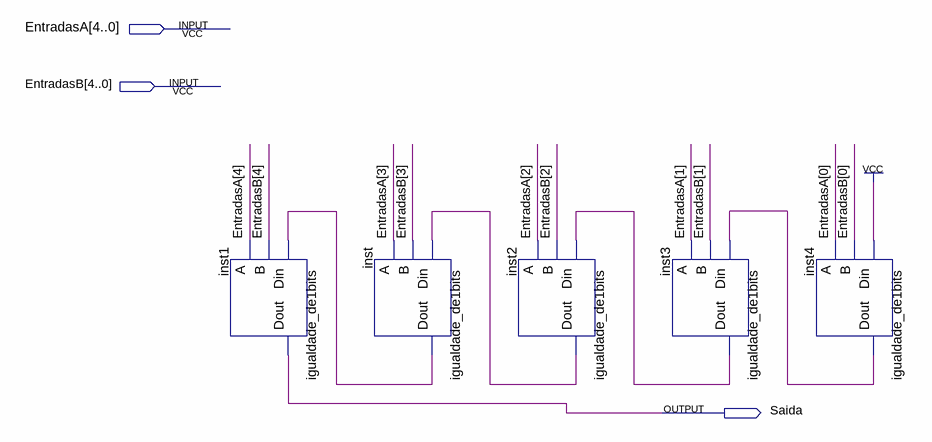
[diagram p0: schematic sheet]
// Quartus schematic igualdade_completo.bdf as structural Verilog: 5 symbols, 3 pins
module igualdade_completo (
  input  [4:0] EntradasA,
  input  [4:0] EntradasB,
  output Saida
);

  wire inst2_dout, inst3_dout, inst4_dout, inst_dout;

  igualdade_de1bits inst1 (.Din(inst_dout), .B(EntradasB[4]), .A(EntradasA[4]), .Dout(Saida));
  igualdade_de1bits inst (.Din(inst2_dout), .B(EntradasB[3]), .A(EntradasA[3]), .Dout(inst_dout));
  igualdade_de1bits inst2 (.Din(inst3_dout), .B(EntradasB[2]), .A(EntradasA[2]), .Dout(inst2_dout));
  igualdade_de1bits inst3 (.Din(inst4_dout), .B(EntradasB[1]), .A(EntradasA[1]), .Dout(inst3_dout));
  igualdade_de1bits inst4 (.Din(1'b1), .B(EntradasB[0]), .A(EntradasA[0]), .Dout(inst4_dout));
endmodule
